# Altium schematic sheet PC2_Dual_Microphone.SchDoc
size 250 x 200 mm
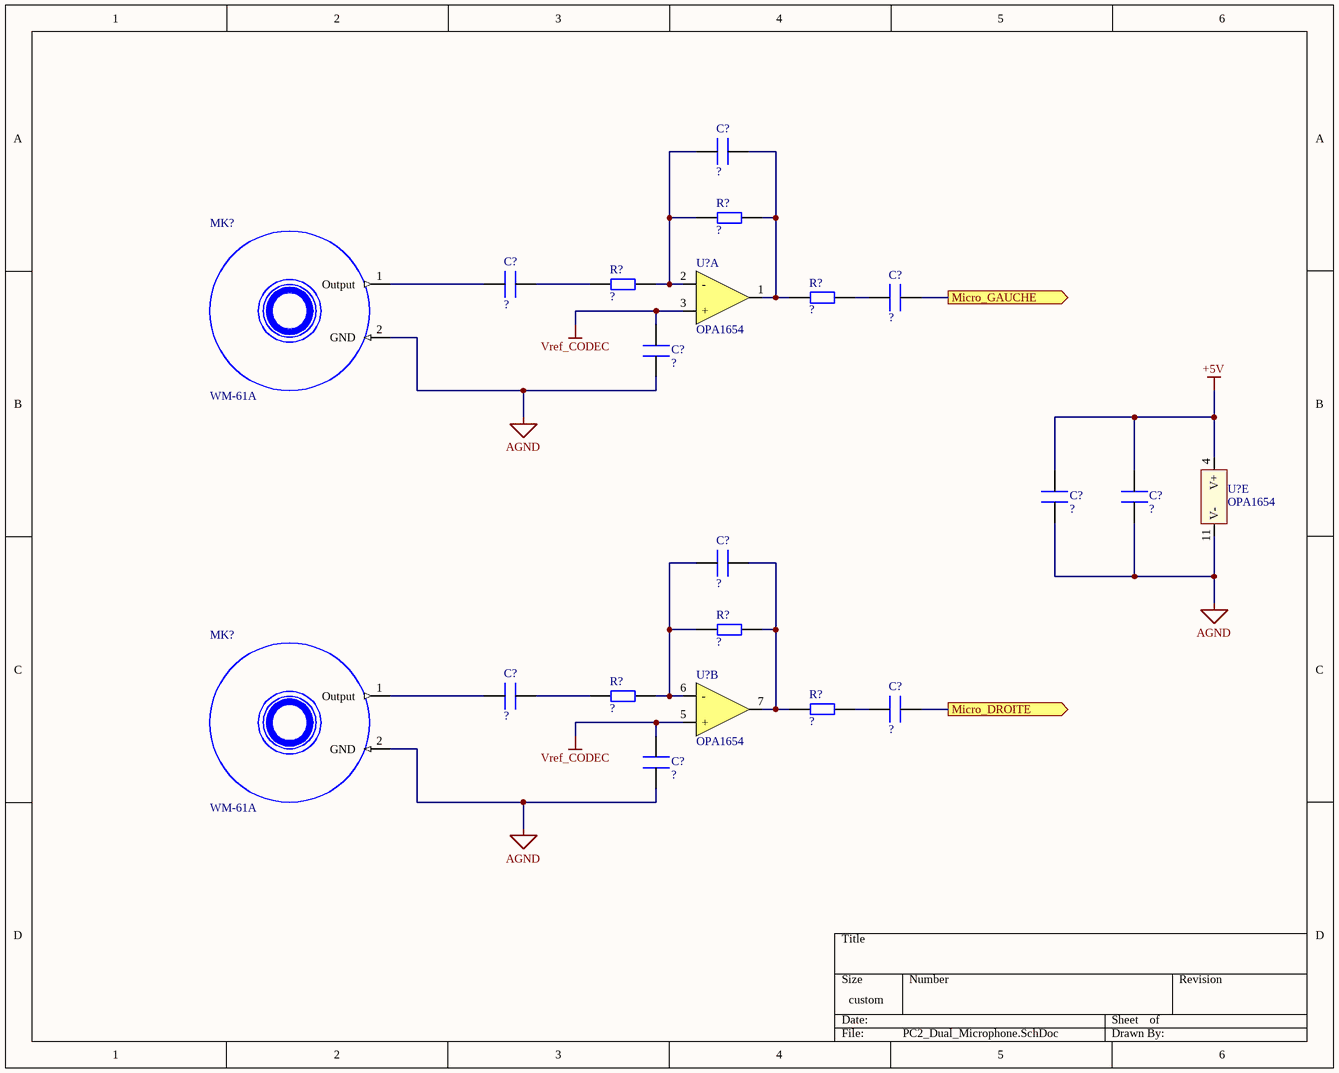
[diagram p0: PC2_Dual_Microphone.SchDoc]

## Parts
(Parts that share a designator on the sheet are numbered #1, #2 ... from top to bottom, then left to right.)
C?#1  Condo  (value not drawn)  (no BOM)
C?#2  Condo  (value not drawn)  (no BOM)
C?#3  Condo  (value not drawn)  (no BOM)
C?#4  Condo  (value not drawn)  (no BOM)
C?#5  Condo  (value not drawn)  (no BOM)
C?#6  Condo  (value not drawn)  (no BOM)
C?#7  Condo  (value not drawn)  (no BOM)
C?#8  Condo  (value not drawn)  (no BOM)
C?#9  Condo  (value not drawn)  (no BOM)
C?#10  Condo  (value not drawn)  (no BOM)
MK?#1  WM-61A
MK?#2  WM-61A
R?#1  Res  (value not drawn)  (no BOM)
R?#2  Res  (value not drawn)  (no BOM)
R?#3  Res  (value not drawn)  (no BOM)
R?#4  Res  (value not drawn)  (no BOM)
R?#5  Res  (value not drawn)  (no BOM)
R?#6  Res  (value not drawn)  (no BOM)
U?#1  OPA1654  (part A of 5)
U?#2  OPA1654  (part E of 5)
U?#3  OPA1654  (part B of 5)

## Ports
Micro_DROITE (out), Micro_GAUCHE (out)

## Nets
+5V: C?#5.2 C?#6.2 U?#2.4(V+)
AGND: C?#4.1 C?#5.1 C?#6.1 C?#10.1 MK?#1.2(GND) MK?#2.2(GND) U?#2.11(V-)
Vref_CODEC: C?#4.2 C?#10.2 U?#1.3(+) U?#3.5(+)
Micro_DROITE: C?#9.2 ; port Micro_DROITE
Micro_GAUCHE: C?#3.2 ; port Micro_GAUCHE
NetC?#1_1: C?#1.1 R?#1.2 R?#3.1 U?#1.1(OUT)
NetC?#1_2: C?#1.2 R?#1.1 R?#2.2 U?#1.2(-)
NetC?#2_1: C?#2.1 MK?#1.1(Output)
NetC?#2_2: C?#2.2 R?#2.1
NetC?#3_1: C?#3.1 R?#3.2
NetC?#7_1: C?#7.1 R?#4.2 R?#6.1 U?#3.7(OUT)
NetC?#7_2: C?#7.2 R?#4.1 R?#5.2 U?#3.6(-)
NetC?#8_1: C?#8.1 MK?#2.1(Output)
NetC?#8_2: C?#8.2 R?#5.1
NetC?#9_1: C?#9.1 R?#6.2

## Library data of the parts
C?#1-C?#10 = Condo: Condensateur; Valeur: ?
MK?#1 MK?#2 = WM-61A: Microphone (sur Header); Fabricant: INSIKES; RefFabricant: WM-61A; DataSheet: https://components101.com/sites/default/files/component_datasheet/Electret%20Condenser%20Microphone.pdf
R?#1-R?#6 = Res: Résistance; Valeur: ?
U?#1-U?#3 = OPA1654: Quad Audio AmpliOp; Fabricant: TEXAS INSTRUMENTS; RefFabricant: OPA1654; DataSheet: http://www.ti.com/lit/ds/symlink/opa1654.pdf